# EAGLE design cp2103 (EAGLE 6.5.0)
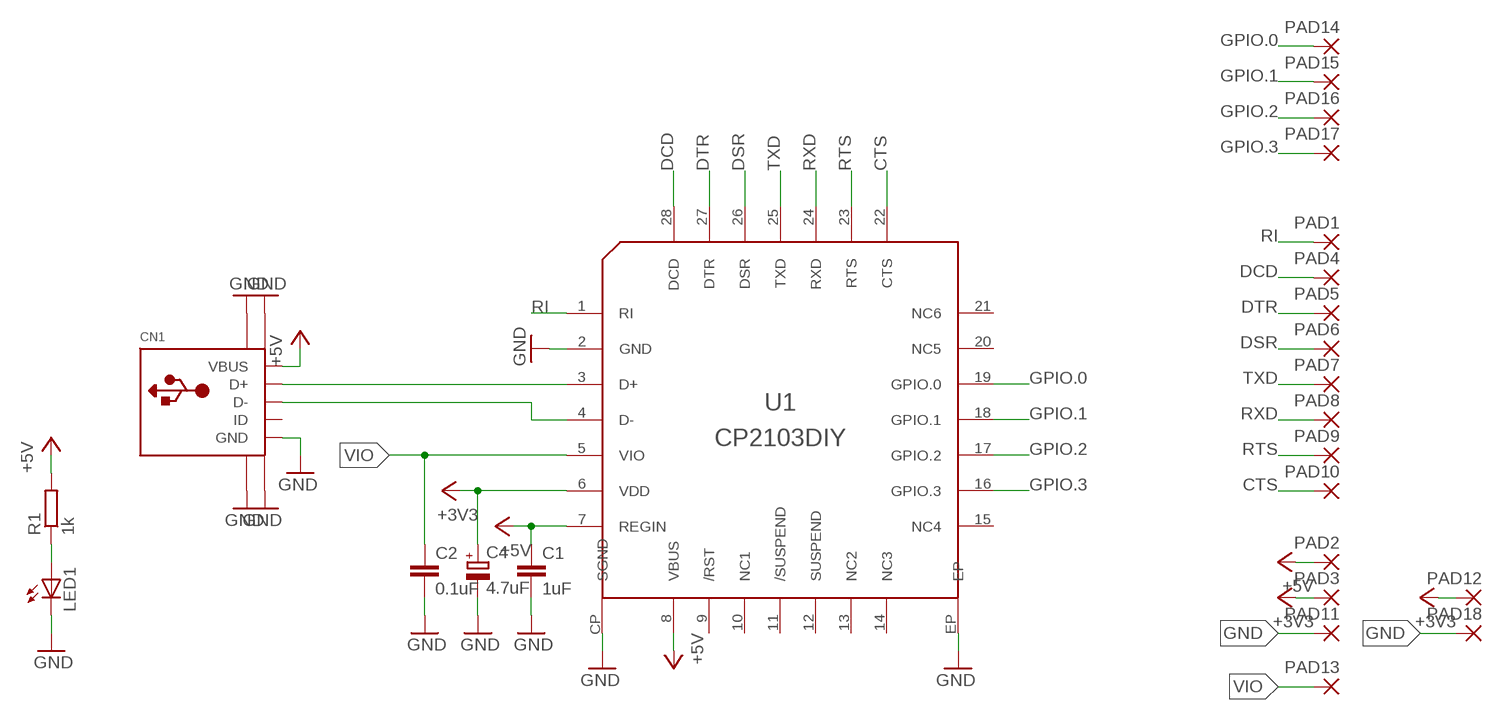
[diagram p0: schematic, sheet 1]

## Parts
C1  1uF  C-EUC0603  [C0603]
C2  0.1uF  C-EUC0603  [C0603]
C4  4.7uF  CPOL-EUSMCB  [SMC_B]
CN1  USBMINIB  [USB-MINIB]
LED1  LEDSML0603  [SML0603]
PAD1  SMD2  [SMD1,27-2,54]
PAD2  SMD2  [SMD1,27-2,54]
PAD3  SMD2  [SMD1,27-2,54]
PAD4  SMD2  [SMD1,27-2,54]
PAD5  SMD2  [SMD1,27-2,54]
PAD6  SMD2  [SMD1,27-2,54]
PAD7  SMD2  [SMD1,27-2,54]
PAD8  SMD2  [SMD1,27-2,54]
PAD9  SMD2  [SMD1,27-2,54]
PAD10  SMD2  [SMD1,27-2,54]
PAD11  SMD2  [SMD1,27-2,54]
PAD12  SMD2  [SMD1,27-2,54]
PAD13  SMD2  [SMD1,27-2,54]
PAD14  SMD2  [SMD1,27-2,54]
PAD15  SMD2  [SMD1,27-2,54]
PAD16  SMD2  [SMD1,27-2,54]
PAD17  SMD2  [SMD1,27-2,54]
PAD18  SMD2  [SMD1,27-2,54]
R1  1k  R-EU_R0603  [R0603]
U1  CP2103DIY  [QFN28-DIY]

## Nets
+3V3: C4.+ PAD3.1(P) U1.6(VDD)
+5V: C1.1 CN1.VBUS PAD2.1(P) PAD12.1(P) R1.2 U1.7(REGIN) U1.8(VBUS) ; supply symbol labelled +3V3
CTS: PAD10.1(P) U1.22(CTS)
DCD: PAD4.1(P) U1.28(DCD)
DSR: PAD6.1(P) U1.26(DSR)
DTR: PAD5.1(P) U1.27(DTR)
GND: C1.2 C2.2 C4.- CN1.GND CN1.GND1(PAD1) CN1.GND2(PAD2) CN1.GND3(PAD3) CN1.GND4(PAD4) LED1.C PAD11.1(P) PAD18.1(P) U1.2(GND) U1.CP(SGND) U1.EP
GPIO.0: PAD14.1(P) U1.19(GPIO.0)
GPIO.1: PAD15.1(P) U1.18(GPIO.1)
GPIO.2: PAD16.1(P) U1.17(GPIO.2)
GPIO.3: PAD17.1(P) U1.16(GPIO.3)
N$1: LED1.A R1.1
N$2: CN1.D+ U1.3(D+)
N$3: CN1.D- U1.4(D-)
RI: PAD1.1(P) U1.1(RI)
RTS: PAD9.1(P) U1.23(RTS)
RXD: PAD8.1(P) U1.24(RXD)
TXD: PAD7.1(P) U1.25(TXD)
VIO: C2.1 PAD13.1(P) U1.5(VIO)
Unconnected: CN1.ID U1.9(/RST) U1.10(NC1) U1.11(/SUSPEND) U1.12(SUSPEND) U1.13(NC2) U1.14(NC3) U1.15(NC4) U1.20(NC5) U1.21(NC6)

## Library data of the parts
C1 C2 = rcl:C-EU: CAPACITOR, European symbol
C4 = rcl:CPOL-EU: POLARIZED CAPACITOR, European symbol
CN1 = adafruit:USB: USB Connectors USBMINIB - Surface Mount Female Mini-B USB Connector 4UConnector: 06564 By microbuilder.eu Thru-hole RA Female Mini-B USB Connector 4UConnector: 18732 By ladyada.net
LED1 = led:LED: LED OSRAM: - CHIPLED LG R971, LG N971, LY N971, LG Q971, LY Q971, LO R971, LY R971 LH N974, LH R974 LS Q976, LO Q976, LY Q976 LO Q996 - Hyper CHIPLED LW Q18S LB Q993, LB Q99A, LB R99A - SideLED LS A670, LO A670, LY A670, LG A670, LP A670 LB A673, LV A673, LT A673, LW A673 LH A674 LY A675 LS A676, LA A676, LO A676, LY A676, LW A676 LS A679, LY A679, LG A679 - Hyper Micro SIDELED® LS Y876, LA Y876, LO Y876, LY Y876 LT Y87S - SmartLED LW L88C, LW L88S LB L89C, LB L89S, LG L890 LS L89K, LO L89K, LY L89K LS L896, LA L896, LO L896, LY L896 - TOPLED LS T670, LO T670, LY T670, LG T670, LP T670 LSG T670, LSP T670, LSY T670, LOP T670, LYG T670 LG T671, LOG T671, LSG T671 LB T673, LV T673, LT T673, LW T673 LH T674 LS T676, LA T676, LO T676, LY T676, LB T676, LH T676, LSB T676, LW T676 LB T67C, LV T67C, LT T67C, LS T67K, LO T67K, LY T67K, LW E67C LS E67B, LA E67B, LO E67B, LY E67B, LB E67C, LV E67C, LT E67C LW T67C LS T679, LY T679, LG T679 LS T770, LO T770, LY T770, LG T770, LP T770 LB T773, LV T773, LT T773, LW T773 LH T774 LS E675, LA E675, LY E675, LS T675 LS T776, LA T776, LO T776, LY T776, LB T776 LHGB T686 LT T68C, LB T68C - Hyper Mini TOPLED® LB M676 - Mini TOPLED Santana® LG M470 LS M47K, LO M47K, LY M47K Source: http://www.osram.convergy.de LUXEON: - LUMILED® LXK2-PW12-R00, LXK2-PW12-S00, LXK2-PW14-U00, LXK2-PW14-V00 LXK2-PM12-R00, LXK2-PM12-S00, LXK2-PM14-U00 LXK2-PE12-Q00, LXK2-PE12-R00, LXK2-PE12-S00, LXK2-PE14-T00, LXK2-PE14-U00 LXK2-PB12-K00, LXK2-PB12-L00, LXK2-PB12-M00, LXK2-PB14-N00, LXK2-PB14-P00, LXK2-PB14-Q00 LXK2-PR12-L00, LXK2-PR12-M00, LXK2-PR14-Q00, LXK2-PR14-R00 LXK2-PD12-Q00, LXK2-PD12-R00, LXK2-PD12-S00 LXK2-PH12-R00, LXK2-PH12-S00 LXK2-PL12-P00, LXK2-PL12-Q00, LXK2-PL12-R00 Source: www.luxeon.com KINGBRIGHT: KA-3528ASYC Source: www.kingbright.com
PAD1-PAD18 = wirepad:SMD2: SMD PAD
R1 = rcl:R-EU_: RESISTOR, European symbol
U1 = alex:CP2103

## Board
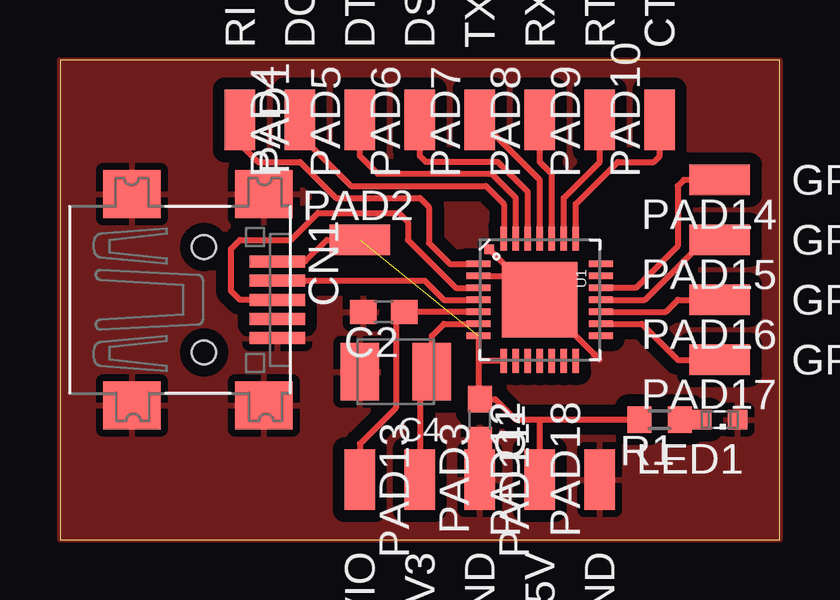
[diagram p1: board, top side]
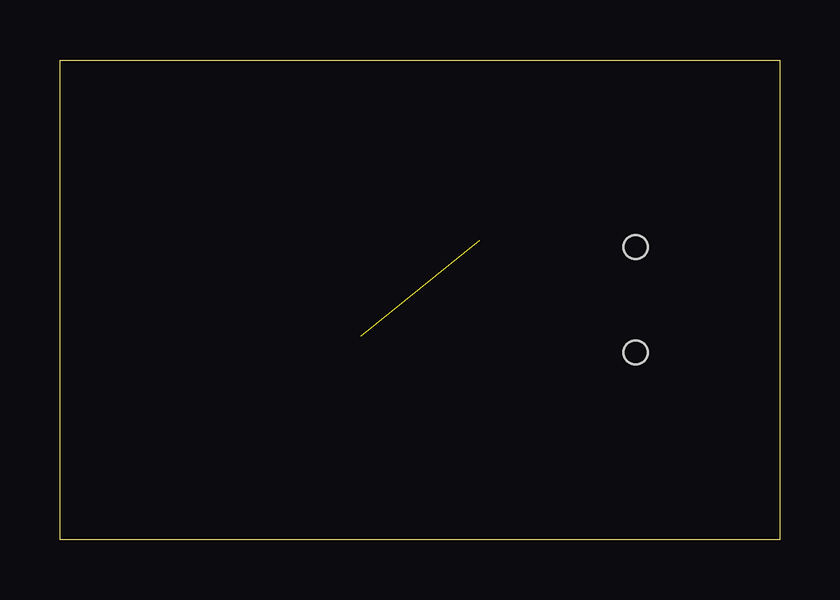
[diagram p2: board, bottom side, seen from below]

Size 30 x 20 mm. Coordinates in mm from the lower left corner, seen from the top.
Outline: 0,0 30,0 30,20 0,20 0,0
Copper layers (1*16): Top 0.035mm / dielectric 1.5mm / Bottom 0.035mm
Design rules "default *": minimum track width 10mil, minimum drill 24mil, track to track 8mil, track to pad 8mil, pad to pad 8mil, via to via 8mil, smd to smd 8mil, copper to edge 0mil, drill to drill 8mil, minimum pad ring 10mil, minimum via ring 8mil, stop-mask expansion 4mil, vias tented up to drill 0mil, thermal gap 12mil

### Footprints (pad centres in the part's own frame; a part is rotated, then mirrored left to right if it is on the bottom)
C0603 = smd 1.1 x 1: 1 -0.85,0; 2 0.85,0
SMC_B = smd 1.6 x 2.4: + -1.5,0; - 1.5,0
USB-MINIB = smd 0.5 x 2.308: D+ 0,4.064; D- -0.8,4.064; GND 1.6,4.064; ID 0.8,4.064; VBUS -1.6,4.064 | smd 2 x 2.4: GND1 -4.4,-2; GND2 -4.4,3.5; GND3 4.4,3.5; GND4 4.4,-2 | hole 1: -2.2,1; 2.2,1
SML0603 = smd 0.8 x 0.8: A 0.75,0; C -0.75,0
SMD1,27-2,54 = smd 1.27 x 2.54: 1 0,0
R0603 = smd 1 x 1.1: 1 -0.85,0; 2 0.85,0
QFN28-DIY = smd 1 x 0.28: 1 -2.55,1.5; 2 -2.55,1; 3 -2.55,0.5; 4 -2.55,0; 5 -2.55,-0.5; 6 -2.55,-1; 7 -2.55,-1.5; 15 2.55,-1.5; 16 2.55,-1; 17 2.55,-0.5; 18 2.55,0; 19 2.55,0.5; 20 2.55,1; 21 2.55,1.5 | smd 0.28 x 1: 8 -1.5,-2.55; 9 -1,-2.55; 10 -0.5,-2.55; 11 0,-2.55; 12 0.5,-2.55; 13 1,-2.55; 14 1.5,-2.55; 22 1.5,2.55; 23 1,2.55; 24 0.5,2.55; 25 0,2.55; 26 -0.5,2.55; 27 -1,2.55; 28 -1.5,2.55 | smd 0.4 x 0.4: CP -2.1,2.1 | smd 3.15 x 3.15: EP 0,0

### Placement (x,y rotation side)
C1  17.5,5 270 top
C2  13.5,9.5 180 top
C4  14,7 180 top
CN1  5,10 270 top
LED1  27.5,5 180 top
PAD1  7.5,17.5 180 top
PAD2  12.5,12.5 270 top
PAD3  15,2.5 180 top
PAD4  10,17.5 0 top
PAD5  12.5,17.5 0 top
PAD6  15,17.5 0 top
PAD7  17.5,17.5 0 top
PAD8  20,17.5 0 top
PAD9  22.5,17.5 0 top
PAD10  25,17.5 0 top
PAD11  17.5,2.5 180 top
PAD12  20,2.5 0 top
PAD13  12.5,2.5 180 top
PAD14  27.5,15 90 top
PAD15  27.5,12.5 90 top
PAD16  27.5,10 90 top
PAD17  27.5,7.5 90 top
PAD18  22.5,2.5 0 top
R1  25,5 180 top
U1  20,10 0 top

### Tracks (layer width: path | path; a pad name or v marks a point on that pad's centre or on a via)
+3V3
  Top 0.25: U1.6 16,9 15.5,8.5 C4.+ 15.5,6.5 15,6 PAD3.1
+5V  (1 unrouted)
  Top 0.25: CN1.VBUS 10.22,11.6 11.12,12.5 PAD2.1 | U1.7 17.45,7.5 | 17.45,7.5 17.45,5.9 C1.1 18.15,5.85 19,5 20,5 | U1.8 17.5,7.45 17.45,7.5 | PAD12.1 20,5 | R1.2 20,5
CTS
  Top 0.25: U1.22 21.5,14 23.25,15.75 24.75,15.75 25,16 PAD10.1
DCD
  Top 0.25: PAD4.1 10,16.88 12.12,14.75 17.75,14.75 18.5,14 U1.28
DSR
  Top 0.25: U1.26 19.5,14.5 18.25,15.75 15.25,15.75 15,16 PAD6.1
DTR
  Top 0.25: U1.27 19,14.25 18,15.25 13.25,15.25 12.5,16 PAD5.1
GND
  Top 0.25: U1.2 19,11 | 19,11 U1.EP 22.5,7.5 | U1.CP 19,11 | C1.2 PAD11.1
  pour Top (isolate 0.5): 0,20 30,20 30,0 0,0
GPIO.0
  Top 0.25: PAD14.1 26,15 25.75,14.75 25.75,12.25 24,10.5 U1.19
GPIO.1
  Top 0.25: U1.18 24.38,10 26.75,12.38 27.38,12.38 PAD15.1
GPIO.2
  Top 0.25: U1.17 25.25,9.5 25.75,10 PAD16.1
GPIO.3
  Top 0.25: U1.16 24.25,9 25.75,7.5 PAD17.1
N$1
  Top 0.25: R1.1 LED1.A
N$2
  Top 0.25: CN1.D+ 7.5,10 7.12,10.38 7.12,12.12 7.5,12.5 9.62,12.5 10.75,13.62 14.12,13.62 14.5,13.25 14.5,12.5 16.5,10.5 U1.3
N$3
  Top 0.25: U1.4 16,10 15.2,10.8 CN1.D-
RI
  Top 0.25: PAD1.1 7.5,16.5 8.25,15.75 10,15.75 11.5,14.25 15,14.25 15.38,13.88 15.38,12.38 16.25,11.5 U1.1
RTS
  Top 0.25: U1.23 21,14.25 22.5,15.75 PAD9.1
RXD
  Top 0.25: U1.24 20.5,15.25 20,15.75 PAD8.1
TXD
  Top 0.25: U1.25 20,15 PAD7.1
VIO
  Top 0.25: U1.5 C2.1 14,9.5 14,5.5 12.5,4 PAD13.1

### Text on the board
Bottom: Additional wire connections required!
tPlace: RI | DCD | DTR | DSR | TXD | RXD | RTS | CTS | GPIO.0 | GPIO.1 | GPIO.2 | GPIO.3 | VIO | 3V3 | GND | 5V | GND